# EasyEDA schematic SCH_G431永磁双驱_2024-10-08.json
TITLE: 双永磁驱动板; REV: 1.0; Date: 2024-09-12; Sheet: 1/1; Drawn By: Pudding; Company: 星火行动
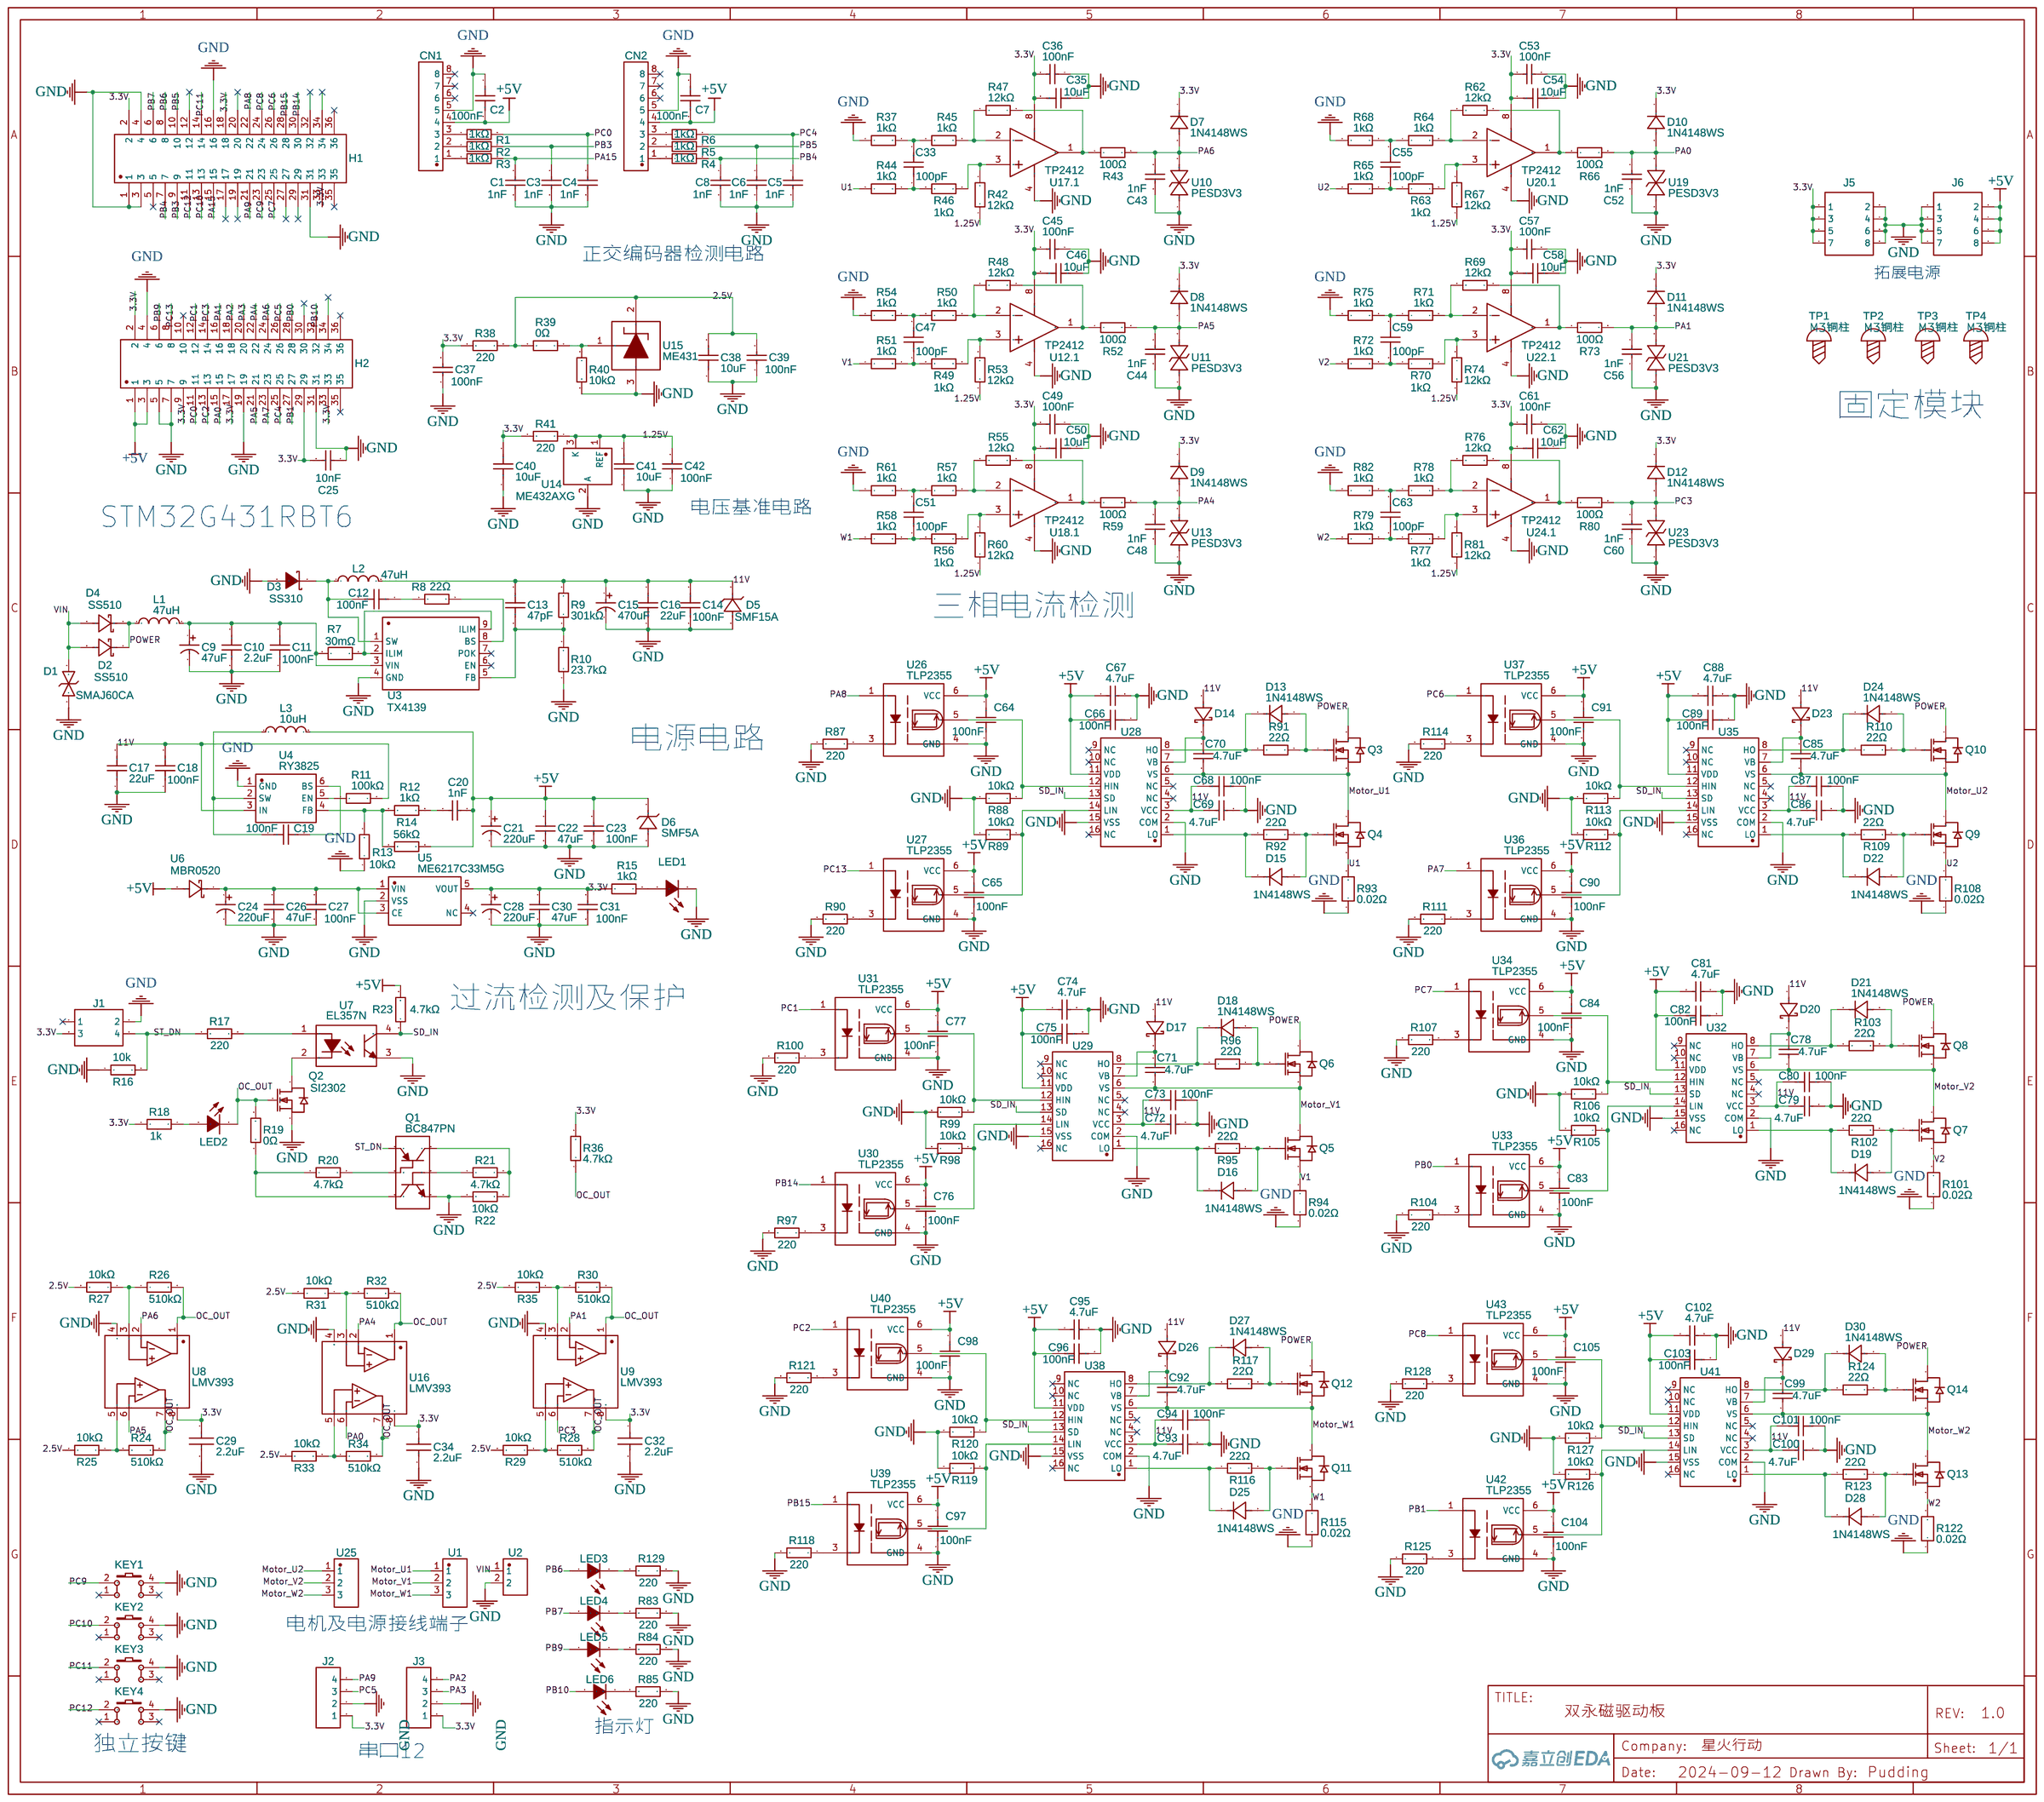
[diagram p0: schematic sheet]

## Parts
C1  1nF  [C0603]
C2  100nF  [C0603]
C3  1nF  [C0603]
C4  1nF  [C0603]
C5  1nF  [C0603]
C6  1nF  [C0603]
C7  100nF  [C0603]
C8  1nF  [C0603]
C9  47uF  [CAP-TH_BD8.0-P3.50-D0.6-FD]
C10  2.2uF  [C1206]
C11  100nF  [C0603]
C12  100nF  [C0603]
C13  47pF  [C0402]
C14  100nF  [C0603]
C15  470uF  [CAP-TH_BD10.0-P5.00-D1.0-FD]
C16  22uF  [C0805]
C17  22uF  [C0805]
C18  100nF  [C0603]
C19  100nF  [C0603]
C20  1nF  [C0603]
C21  220uF  [CAP-SMD_BD6.3-L6.6-W6.6-FD]
C22  47uF  [C0805]
C23  100nF  [C0402]
C24  220uF  [CAP-SMD_BD6.3-L6.6-W6.6-FD]
C25  10nF  [C0805]
C26  47uF  [C0805]
C27  100nF  [C0402]
C28  220uF  [CAP-SMD_BD6.3-L6.6-W6.6-FD]
C29  2.2uF  [C0402]
C30  47uF  [C0805]
C31  100nF  [C0402]
C32  2.2uF  [C0402]
C33  100pF  [C0603]
C34  2.2uF  [C0402]
C35  10uF  [C0603]
C36  100nF  [C0402]
C37  100nF  [C0402]
C38  10uF  [C0603]
C39  100nF  [C0402]
C40  10uF  [C0603]
C41  10uF  [C0603]
C42  100nF  [C0402]
C43  1nF  [C0603]
C44  1nF  [C0603]
C45  100nF  [C0402]
C46  10uF  [C0603]
C47  100pF  [C0603]
C48  1nF  [C0603]
C49  100nF  [C0402]
C50  10uF  [C0603]
C51  100pF  [C0603]
C52  1nF  [C0603]
C53  100nF  [C0402]
C54  10uF  [C0603]
C55  100pF  [C0603]
C56  1nF  [C0603]
C57  100nF  [C0402]
C58  10uF  [C0603]
C59  100pF  [C0603]
C60  1nF  [C0603]
C61  100nF  [C0402]
C62  10uF  [C0603]
C63  100pF  [C0603]
C64  100nF  [C0603]
C65  100nF  [C0603]
C66  100nF  [C0603]
C67  4.7uF  [C0805]
C68  100nF  [C0603]
C69  4.7uF  [C0805]
C70  4.7uF  [C0805]
C71  4.7uF  [C0805]
C72  4.7uF  [C0805]
C73  100nF  [C0603]
C74  4.7uF  [C0805]
C75  100nF  [C0603]
C76  100nF  [C0603]
C77  100nF  [C0603]
C78  4.7uF  [C0805]
C79  4.7uF  [C0805]
C80  100nF  [C0603]
C81  4.7uF  [C0805]
C82  100nF  [C0603]
C83  100nF  [C0603]
C84  100nF  [C0603]
C85  4.7uF  [C0805]
C86  4.7uF  [C0805]
C87  100nF  [C0603]
C88  4.7uF  [C0805]
C89  100nF  [C0603]
C90  100nF  [C0603]
C91  100nF  [C0603]
C92  4.7uF  [C0805]
C93  4.7uF  [C0805]
C94  100nF  [C0603]
C95  4.7uF  [C0805]
C96  100nF  [C0603]
C97  100nF  [C0603]
C98  100nF  [C0603]
C99  4.7uF  [C0805]
C100  4.7uF  [C0805]
C101  100nF  [C0603]
C102  4.7uF  [C0805]
C103  100nF  [C0603]
C104  100nF  [C0603]
C105  100nF  [C0603]
CN1  JL396V-39608G01  [CONN-TH_8P-P3.96_JILN_JL396V-39608G01]
CN2  JL396V-39608G01  [CONN-TH_8P-P3.96_JILN_JL396V-39608G01]
D1  SMAJ60CA  [SMA_L4.4-W2.8-LS5.1-BI]
D2  SS510  [SMA_L4.3-W2.6-LS5.0-RD]
D3  SS310  [SMA_L4.3-W2.6-LS5.2-RD]
D4  SS510  [SMA_L4.3-W2.6-LS5.0-RD]
D5  SMF15A  [SOD-123FL_L2.7-W1.8-LS3.8-RD]
D6  SMF5A  [SOD-123FL_L2.7-W1.8-LS3.8-RD]
D7  1N4148WS  [SOD-323_L1.8-W1.3-LS2.5-RD]
D8  1N4148WS  [SOD-323_L1.8-W1.3-LS2.5-RD]
D9  1N4148WS  [SOD-323_L1.8-W1.3-LS2.5-RD]
D10  1N4148WS  [SOD-323_L1.8-W1.3-LS2.5-RD]
D11  1N4148WS  [SOD-323_L1.8-W1.3-LS2.5-RD]
D12  1N4148WS  [SOD-323_L1.8-W1.3-LS2.5-RD]
D13  1N4148WS  [SOD-323_L1.8-W1.3-LS2.5-RD]
D14  DSK110_C908227  [SOD-123_L2.8-W1.8-LS3.7-FD]
D15  1N4148WS  [SOD-323_L1.8-W1.3-LS2.5-RD]
D16  1N4148WS  [SOD-323_L1.8-W1.3-LS2.5-RD]
D17  DSK110_C908227  [SOD-123_L2.8-W1.8-LS3.7-FD]
D18  1N4148WS  [SOD-323_L1.8-W1.3-LS2.5-RD]
D19  1N4148WS  [SOD-323_L1.8-W1.3-LS2.5-RD]
D20  DSK110_C908227  [SOD-123_L2.8-W1.8-LS3.7-FD]
D21  1N4148WS  [SOD-323_L1.8-W1.3-LS2.5-RD]
D22  1N4148WS  [SOD-323_L1.8-W1.3-LS2.5-RD]
D23  DSK110_C908227  [SOD-123_L2.8-W1.8-LS3.7-FD]
D24  1N4148WS  [SOD-323_L1.8-W1.3-LS2.5-RD]
D25  1N4148WS  [SOD-323_L1.8-W1.3-LS2.5-RD]
D26  DSK110_C908227  [SOD-123_L2.8-W1.8-LS3.7-FD]
D27  1N4148WS  [SOD-323_L1.8-W1.3-LS2.5-RD]
D28  1N4148WS  [SOD-323_L1.8-W1.3-LS2.5-RD]
D29  DSK110_C908227  [SOD-123_L2.8-W1.8-LS3.7-FD]
D30  1N4148WS  [SOD-323_L1.8-W1.3-LS2.5-RD]
H1  210S-2*18P L=11.6MMGold-plated black  [HDR-TH_36P-P2.54-V-M-R2-C18-S2.54-1]
H2  210S-2*18P L=11.6MMGold-plated black  [HDR-TH_36P-P2.54-V-M-R2-C18-S2.54-1]
J1  HDR-M-2.54_2x2  [HDR-M-2.54_2X2]
J2  HDR-M-2.54_1x4  [HDR-M-2.54_1X4]
J3  HDR-M-2.54_1x4  [HDR-M-2.54_1X4]
J5  HDR-M-2.54_2x4  [HDR-M-2.54_2X4]
J6  HDR-M-2.54_2x4  [HDR-M-2.54_2X4]
KEY1  K4-6×6_TH  [KEY-TH_4P-L6.0-W6.0-P4.50-LS6.5]
KEY2  K4-6×6_TH  [KEY-TH_4P-L6.0-W6.0-P4.50-LS6.5]
KEY3  K4-6×6_TH  [KEY-TH_4P-L6.0-W6.0-P4.50-LS6.5]
KEY4  K4-6×6_TH  [KEY-TH_4P-L6.0-W6.0-P4.50-LS6.5]
L1  47uH  [IND-SMD_L11.5-W10.0_SMMS1040]
L2  47uH  [IND-SMD_L11.5-W10.0_SMMS1040]
L3  10uH  [IND-SMD_L7.3-W6.8]
LED1  204-10SUGD/S400-A4-L  [LED-TH_BD3.9-P2.54-RD]
LED2  发光二极管_红色  [LED-TH_BD4.0-P2.54-FD]
LED3  333-2SYGD/S530-E2  [LED-TH_BD5.8-P2.54-L-RD]
LED4  333-2SYGD/S530-E2  [LED-TH_BD5.8-P2.54-L-RD]
LED5  333-2SYGD/S530-E2  [LED-TH_BD5.8-P2.54-L-RD]
LED6  333-2SYGD/S530-E2  [LED-TH_BD5.8-P2.54-L-RD]
Q1  BC847PN  [SOT-363_L2.1-W1.3-P0.65-LS2.3-BL]
Q2  SI2302  [SOT-23-3_L2.9-W1.3-P1.90-LS2.4-BR]
Q3  IRFS3607TRLPBF  [TO-263-2_L10.0-W9.1-P5.08-LS15.2-TL]
Q4  IRFS3607TRLPBF  [TO-263-2_L10.0-W9.1-P5.08-LS15.2-TL]
Q5  IRFS3607TRLPBF  [TO-263-2_L10.0-W9.1-P5.08-LS15.2-TL]
Q6  IRFS3607TRLPBF  [TO-263-2_L10.0-W9.1-P5.08-LS15.2-TL]
Q7  IRFS3607TRLPBF  [TO-263-2_L10.0-W9.1-P5.08-LS15.2-TL]
Q8  IRFS3607TRLPBF  [TO-263-2_L10.0-W9.1-P5.08-LS15.2-TL]
Q9  IRFS3607TRLPBF  [TO-263-2_L10.0-W9.1-P5.08-LS15.2-TL]
Q10  IRFS3607TRLPBF  [TO-263-2_L10.0-W9.1-P5.08-LS15.2-TL]
Q11  IRFS3607TRLPBF  [TO-263-2_L10.0-W9.1-P5.08-LS15.2-TL]
Q12  IRFS3607TRLPBF  [TO-263-2_L10.0-W9.1-P5.08-LS15.2-TL]
Q13  IRFS3607TRLPBF  [TO-263-2_L10.0-W9.1-P5.08-LS15.2-TL]
Q14  IRFS3607TRLPBF  [TO-263-2_L10.0-W9.1-P5.08-LS15.2-TL]
R1  1kΩ  [R0805]
R2  1kΩ  [R0805]
R3  1kΩ  [R0805]
R4  1kΩ  [R0805]
R5  1kΩ  [R0805]
R6  1kΩ  [R0805]
R7  30mΩ  [R1206]
R8  22Ω  [R0603]
R9  301kΩ  [R1206]
R10  23.7kΩ  [R0603]
R11  100kΩ  [R0805]
R12  1kΩ  [R0603]
R13  10kΩ  [R0603]
R14  56kΩ  [R0603]
R15  1kΩ  [RES-TH_BD2.2-L6.5-P10.50-D0.6]
R16  10k  [RES-TH_BD2.2-L6.5-P10.50-D0.6]
R17  220  [RES-TH_BD2.2-L6.5-P10.50-D0.6]
R18  1k  [RES-TH_BD2.2-L6.5-P10.50-D0.6]
R19  0Ω  [R0603]
R20  4.7kΩ  [R0603]
R21  4.7kΩ  [R0603]
R22  10kΩ  [R0603]
R23  4.7kΩ  [R0603]
R24  510kΩ  [R0603]
R25  10kΩ  [R0603]
R26  510kΩ  [R0603]
R27  10kΩ  [R0603]
R28  510kΩ  [R0603]
R29  10kΩ  [R0603]
R30  510kΩ  [R0603]
R31  10kΩ  [R0603]
R32  510kΩ  [R0603]
R33  10kΩ  [R0603]
R34  510kΩ  [R0603]
R35  10kΩ  [R0603]
R36  4.7kΩ  [R0603]
R37  1kΩ  [R0603]
R38  220  [RES-TH_BD2.2-L6.5-P10.50-D0.6]
R39  0Ω  [R0603]
R40  10kΩ  [R0603]
R41  220  [RES-TH_BD2.2-L6.5-P10.50-D0.6]
R42  12kΩ  [R0603]
R43  100Ω  [R0603]
R44  1kΩ  [R0603]
R45  1kΩ  [R0603]
R46  1kΩ  [R0603]
R47  12kΩ  [R0603]
R48  12kΩ  [R0603]
R49  1kΩ  [R0603]
R50  1kΩ  [R0603]
R51  1kΩ  [R0603]
R52  100Ω  [R0603]
R53  12kΩ  [R0603]
R54  1kΩ  [R0603]
R55  12kΩ  [R0603]
R56  1kΩ  [R0603]
R57  1kΩ  [R0603]
R58  1kΩ  [R0603]
R59  100Ω  [R0603]
R60  12kΩ  [R0603]
R61  1kΩ  [R0603]
R62  12kΩ  [R0603]
R63  1kΩ  [R0603]
R64  1kΩ  [R0603]
R65  1kΩ  [R0603]
R66  100Ω  [R0603]
R67  12kΩ  [R0603]
R68  1kΩ  [R0603]
R69  12kΩ  [R0603]
R70  1kΩ  [R0603]
R71  1kΩ  [R0603]
R72  1kΩ  [R0603]
R73  100Ω  [R0603]
R74  12kΩ  [R0603]
R75  1kΩ  [R0603]
R76  12kΩ  [R0603]
R77  1kΩ  [R0603]
R78  1kΩ  [R0603]
R79  1kΩ  [R0603]
R80  100Ω  [R0603]
R81  12kΩ  [R0603]
R82  1kΩ  [R0603]
R83  220  [RES-TH_BD2.2-L6.5-P10.50-D0.6]
R84  220  [RES-TH_BD2.2-L6.5-P10.50-D0.6]
R85  220  [RES-TH_BD2.2-L6.5-P10.50-D0.6]
R87  220  [RES-TH_BD2.2-L6.5-P10.50-D0.6]
R88  10kΩ  [R0603]
R89  10kΩ  [R0603]
R90  220  [RES-TH_BD2.2-L6.5-P10.50-D0.6]
R91  22Ω  [R0805]
R92  22Ω  [R0805]
R93  0.02Ω  [RES-SMD_L6.4-W3.2-R2512]
R94  0.02Ω  [RES-SMD_L6.4-W3.2-R2512]
R95  22Ω  [R0805]
R96  22Ω  [R0805]
R97  220  [RES-TH_BD2.2-L6.5-P10.50-D0.6]
R98  10kΩ  [R0603]
R99  10kΩ  [R0603]
R100  220  [RES-TH_BD2.2-L6.5-P10.50-D0.6]
R101  0.02Ω  [RES-SMD_L6.4-W3.2-R2512]
R102  22Ω  [R0805]
R103  22Ω  [R0805]
R104  220  [RES-TH_BD2.2-L6.5-P10.50-D0.6]
R105  10kΩ  [R0603]
R106  10kΩ  [R0603]
R107  220  [RES-TH_BD2.2-L6.5-P10.50-D0.6]
R108  0.02Ω  [RES-SMD_L6.4-W3.2-R2512]
R109  22Ω  [R0805]
R110  22Ω  [R0805]
R111  220  [RES-TH_BD2.2-L6.5-P10.50-D0.6]
R112  10kΩ  [R0603]
R113  10kΩ  [R0603]
R114  220  [RES-TH_BD2.2-L6.5-P10.50-D0.6]
R115  0.02Ω  [RES-SMD_L6.4-W3.2-R2512]
R116  22Ω  [R0805]
R117  22Ω  [R0805]
R118  220  [RES-TH_BD2.2-L6.5-P10.50-D0.6]
R119  10kΩ  [R0603]
R120  10kΩ  [R0603]
R121  220  [RES-TH_BD2.2-L6.5-P10.50-D0.6]
R122  0.02Ω  [RES-SMD_L6.4-W3.2-R2512]
R123  22Ω  [R0805]
R124  22Ω  [R0805]
R125  220  [RES-TH_BD2.2-L6.5-P10.50-D0.6]
R126  10kΩ  [R0603]
R127  10kΩ  [R0603]
R128  220  [RES-TH_BD2.2-L6.5-P10.50-D0.6]
R129  220  [RES-TH_BD2.2-L6.5-P10.50-D0.6]
TP1  M3铜柱  [M3铜柱]
TP2  M3铜柱  [M3铜柱]
TP3  M3铜柱  [M3铜柱]
TP4  M3铜柱  [M3铜柱]
U1  DB301V-5.0-3P-BU-P  [CONN-TH_3P-P5.00_DB301V-5.0-3P-BU-P]
U2  DB127V-5.0-2P-BU-S  [CONN-TH_DB127V-5.0-2P-XX-S]
U3  TX4139  [SOIC-8_L4.9-W3.9-P1.27-LS6.0-BL-EP]
U4  RY3825  [SOT-23-6_L2.9-W1.6-P0.95-LS2.8-BR]
U5  ME6217C33M5G  [SOT-23-5_L3.0-W1.7-P0.95-LS2.8-BR]
U6  MBR0520  [SOD-123_L2.7-W1.6-LS3.7-RD-A]
U7  EL357N  [OPTO-SMD-4_L4.4-W4.1-P2.54-LS7.0-TL]
U8  LMV393  [MSOP-8_L3.0-W3.0-P0.65-LS5.0-BL]
U9  LMV393  [MSOP-8_L3.0-W3.0-P0.65-LS5.0-BL]
U10  PESD3V3  [SOD-323_L1.7-W1.3-LS2.6-BI]
U11  PESD3V3  [SOD-323_L1.7-W1.3-LS2.6-BI]
U12  TP2412  [SOP-8_L3.0-W3.0-P0.65-LS4.9-BL]  (section 1)
U13  PESD3V3  [SOD-323_L1.7-W1.3-LS2.6-BI]
U14  ME432AXG  [SOT-23-3_L2.9-W1.3-P1.90-LS2.4-BR-CW]
U15  ME431  [SOT-23-3_L2.9-W1.3-P1.90-LS2.4-BR]
U16  LMV393  [MSOP-8_L3.0-W3.0-P0.65-LS5.0-BL]
U17  TP2412  [SOP-8_L3.0-W3.0-P0.65-LS4.9-BL]  (section 1)
U18  TP2412  [SOP-8_L3.0-W3.0-P0.65-LS4.9-BL]  (section 1)
U19  PESD3V3  [SOD-323_L1.7-W1.3-LS2.6-BI]
U20  TP2412  [SOP-8_L3.0-W3.0-P0.65-LS4.9-BL]  (section 1)
U21  PESD3V3  [SOD-323_L1.7-W1.3-LS2.6-BI]
U22  TP2412  [SOP-8_L3.0-W3.0-P0.65-LS4.9-BL]  (section 1)
U23  PESD3V3  [SOD-323_L1.7-W1.3-LS2.6-BI]
U24  TP2412  [SOP-8_L3.0-W3.0-P0.65-LS4.9-BL]  (section 1)
U25  DB301V-5.0-3P-BU-P  [CONN-TH_3P-P5.00_DB301V-5.0-3P-BU-P]
U26  TLP2355  [SOP-6_5P-L4.4-W3.6-P1.27-LS7.0-BR-PE2]
U27  TLP2355  [SOP-6_5P-L4.4-W3.6-P1.27-LS7.0-BR-PE2]
U28  IR2110SPBF  [SOIC-16_L10.3-W7.5-P1.27-LS10.3-BL]
U29  IR2110SPBF  [SOIC-16_L10.3-W7.5-P1.27-LS10.3-BL]
U30  TLP2355  [SOP-6_5P-L4.4-W3.6-P1.27-LS7.0-BR-PE2]
U31  TLP2355  [SOP-6_5P-L4.4-W3.6-P1.27-LS7.0-BR-PE2]
U32  IR2110SPBF  [SOIC-16_L10.3-W7.5-P1.27-LS10.3-BL]
U33  TLP2355  [SOP-6_5P-L4.4-W3.6-P1.27-LS7.0-BR-PE2]
U34  TLP2355  [SOP-6_5P-L4.4-W3.6-P1.27-LS7.0-BR-PE2]
U35  IR2110SPBF  [SOIC-16_L10.3-W7.5-P1.27-LS10.3-BL]
U36  TLP2355  [SOP-6_5P-L4.4-W3.6-P1.27-LS7.0-BR-PE2]
U37  TLP2355  [SOP-6_5P-L4.4-W3.6-P1.27-LS7.0-BR-PE2]
U38  IR2110SPBF  [SOIC-16_L10.3-W7.5-P1.27-LS10.3-BL]
U39  TLP2355  [SOP-6_5P-L4.4-W3.6-P1.27-LS7.0-BR-PE2]
U40  TLP2355  [SOP-6_5P-L4.4-W3.6-P1.27-LS7.0-BR-PE2]
U41  IR2110SPBF  [SOIC-16_L10.3-W7.5-P1.27-LS10.3-BL]
U42  TLP2355  [SOP-6_5P-L4.4-W3.6-P1.27-LS7.0-BR-PE2]
U43  TLP2355  [SOP-6_5P-L4.4-W3.6-P1.27-LS7.0-BR-PE2]

## Library data of the parts
C1 C3-C6 C8 C43 C44 C48 C52 C56 C60 = CC0603KRX7R9BB102: Supplier: LCSC; Manufacturer: YAGEO(国巨); Supplier Part: C100040; JLCPCB Part Class: Extended Part
C2 C7 = CC0603KRX7R9BB104: Supplier: LCSC; Manufacturer: YAGEO(国巨); Supplier Part: C14663; JLCPCB Part Class: Basic Part
C9 = ERS1KM470F12OT: Contributor: LCSC; Supplier: LCSC; Manufacturer: AISHI(艾华集团); Supplier Part: C106688; JLCPCB Part Class: Extended Part
C10 = CL31B225KCHSNNE: Contributor: LCSC; Supplier: LCSC; Supplier Part: C170101; Manufacturer: SAMSUNG(三星); JLCPCB Part Class: Extended Part
C11 C12 C14 C18 C19 C64-C66 C68 C73 C75-C77 C80 C82-C84 C87 C89-C91 C94 C96-C98 C101 C103-C105 = CL10B104KC8NNNC: Supplier: LCSC; Manufacturer: SAMSUNG(三星); Supplier Part: C15725; JLCPCB Part Class: Extended Part
C13 = 0402CG470G500NT: Contributor: LCSC; Supplier: LCSC; Supplier Part: C285090; Manufacturer: FH(风华); JLCPCB Part Class: Extended Part
C15 = ERS1HM471G20OT: Supplier: LCSC; Manufacturer: AISHI(艾华集团); Supplier Part: C106666; JLCPCB Part Class: Extended Part
C16 C17 = CL21A226MAQNNNE: Supplier: LCSC; Manufacturer: SAMSUNG(三星); Supplier Part: C45783; JLCPCB Part Class: Basic Part
C20 = CL10B102KB8NNNC: Supplier: LCSC; Manufacturer: SAMSUNG(三星); Supplier Part: C1588; JLCPCB Part Class: Basic Part
C21 C24 C28 = VT1C221M0607: Supplier: LCSC; Manufacturer: ROQANG(容强); Supplier Part: C90274
C22 C26 C30 = CL21A476MQYNNNE: Supplier: LCSC; Manufacturer: SAMSUNG(三星); Supplier Part: C16780; JLCPCB Part Class: Basic Part
C23 C27 C31 C36 C37 C39 C42 C45 C49 C53 C57 C61 = 0402B104K160NT: Supplier: LCSC; Manufacturer: FH(风华); Supplier Part: C41851; JLCPCB Part Class: Extended Part
C25 = CL21A106KAYNNNE: Supplier: LCSC; Manufacturer: SAMSUNG; LCSC Assembly: Yes; Supplier Part: C15850; SMT Type: Basic
C29 C32 C34 = CL05A225MQ5NSNC: Supplier: LCSC; Manufacturer: SAMSUNG(三星); Supplier Part: C12530; JLCPCB Part Class: Basic Part
C33 C47 C51 C55 C59 C63 = CC0603JRNPO9BN101: Supplier: LCSC; Manufacturer: YAGEO(国巨); Supplier Part: C14665; JLCPCB Part Class: Extended Part
C35 C38 C40 C41 C46 C50 C54 C58 C62 = CL10A106KP8NNNC: Supplier: LCSC; Manufacturer: SAMSUNG(三星); Supplier Part: C19702; JLCPCB Part Class: Basic Part
C67 C69-C72 C74 C78 C79 C81 C85 C86 C88 C92 C93 C95 C99 C100 C102 = CL21A475KAQNNNE: Supplier: LCSC; Manufacturer: SAMSUNG(三星); Supplier Part: C1779; JLCPCB Part Class: Basic Part
CN1 CN2 = JL396V-39608G01: Contributor: LCSC; Supplier: LCSC; Supplier Part: C2913363; Manufacturer: JILN(锦凌); JLCPCB Part Class: Extended Part
D1 = SMAJ60CA_C2922199: Contributor: LCSC; Supplier: LCSC; Supplier Part: C2922199; Manufacturer: GOODWORK(固得沃克); JLCPCB Part Class: Extended Part
D2 D4 = SS510_C727067: Contributor: LCSC; Supplier: LCSC; Supplier Part: C727067; Manufacturer: TWGMC(台湾迪嘉); JLCPCB Part Class: Extended Part
D3 = SS310: Supplier: LCSC; Manufacturer: MDD(辰达半导体); Supplier Part: C15874; JLCPCB Part Class: Extended Part
D5 = SMF15A_C19077509: Supplier: LCSC; Supplier Part: C19077509; Manufacturer: 宏迦橙; Contributor: lcsc
D6 = SMF5.0A_C908213: Contributor: LCSC; Supplier: LCSC; Supplier Part: C908213; Manufacturer: FUXINSEMI(富芯森美); Manufacturer Part: SMF5.0A; JLCPCB Part Class: Extended Part
D7-D13 D15 D16 D18 D19 D21 D22 D24 D25 D27 D28 D30 = 1N4148WS_C917117: Contributor: LCSC; Supplier: LCSC; Supplier Part: C917117; Manufacturer: JSMSEMI(杰盛微); JLCPCB Part Class: Extended Part
D14 D17 D20 D23 D26 D29 = DSK110_C908227: Contributor: LCSC; Supplier: LCSC; Supplier Part: C908227; Manufacturer: FUXINSEMI(富芯森美); Manufacturer Part: DSK110; JLCPCB Part Class: Extended Part
H1 H2 = 210S-2*18P L=11.6MMGold-plated black: Contributor: LCSC; Supplier: LCSC; Supplier Part: C168945; Manufacturer: Ckmtw(灿科盟); JLCPCB Part Class: Extended Part
J1 = HDR-M-2.54_2x2: Supplier Part: C66690; Supplier: LCSC; Contributor: LCEDA_Lib
J2 J3 = HDR-M-2.54_1x4: Supplier Part: C124378; Supplier: LCSC; Contributor: LCEDA_Lib
J5 J6 = HDR-M-2.54_2x4: Supplier Part: C58363; Supplier: LCSC; Contributor: LCEDA_Lib
KEY1-KEY4 = K4-6×6_TH: Supplier: LCSC; Supplier Part: C136684; Manufacturer: 韩国韩荣; Manufacturer Part: K2-1102DP-E4SW-04; Contributor: LCEDA_Lib
L1 L2 = SMMS1040-470M: Supplier: LCSC; Manufacturer: SXN(顺翔诺); Supplier Part: C149599; JLCPCB Part Class: Extended Part
L3 = FXL0630-100-M: Contributor: LCSC; Supplier: LCSC; Manufacturer: cjiang(长江微电); Supplier Part: C167223; JLCPCB Part Class: Extended Part
LED1 = 204-10SUGD/S400-A4-L: Contributor: lcsc; Supplier: LCSC; Supplier Part: C778892; Manufacturer: EVERLIGHT(亿光); JLCPCB Part Class: Extended Part
LED2 = 发光二极管_红色: Contributor: lcsc; Supplier: LCSC; Supplier Part: C9900001850; Manufacturer: null; JLCPCB Part Class: Extended Part
LED3-LED6 = 333-2SYGD/S530-E2: Supplier: LCSC; Manufacturer: EVERLIGHT; Supplier Part: C88163; Paste Type: expand
Q1 = BC847PN: Contributor: lcsc; Supplier: LCSC; Supplier Part: C2991946; Manufacturer: CJ(江苏长电/长晶); JLCPCB Part Class: Extended Part
Q2 = SI2302_C4748714: Contributor: lcsc; Supplier: LCSC; Supplier Part: C4748714; Manufacturer: HXY MOSFET(华轩阳电子); Manufacturer Part: SI2302-HXY; JLCPCB Part Class: Extended Part
Q3-Q14 = IRFS3607TRLPBF: Supplier: LCSC; Manufacturer: Infineon(英飞凌); Supplier Part: C22162; JLCPCB Part Class: Extended Part
R1-R6 = 0805W8F1001T5E: Supplier: LCSC; Manufacturer: UNI-ROYAL(厚声); Supplier Part: C17513; JLCPCB Part Class: Basic Part
R7 = HOYLR1206-1W-30MR-1%: Supplier: LCSC; Supplier Part: C5375399; Manufacturer: Milliohm(毫欧); Manufacturer Part: HoYLR1206-1W-30mR-1%; Contributor: lcsc; JLCPCB Part Class: Extended Part
R8 = 0603WAF220JT5E: Supplier: LCSC; Manufacturer: UNI-ROYAL(厚声); Supplier Part: C23345; JLCPCB Part Class: Basic Part
R9 = RCT06301KFLF: Contributor: LCSC; Supplier: LCSC; Supplier Part: C185725; Manufacturer: HKR(香港电阻); JLCPCB Part Class: Extended Part
R10 = 0603WAF2372T5E: Supplier: LCSC; Manufacturer: UNI-ROYAL(厚声); Supplier Part: C22912; JLCPCB Part Class: Extended Part
R11 = 0805W8F1003T5E_C149504: Contributor: LCSC; Supplier: LCSC; Supplier Part: C149504; Manufacturer: UNI-ROYAL(厚声); Manufacturer Part: 0805W8F1003T5E; JLCPCB Part Class: Basic Part
R12 R37 R44-R46 R49-R51 R54 R56-R58 R61 R63-R65 R68 R70-R72 R75 R77-R79 R82 = 0603WAF1001T5E: Supplier: LCSC; Manufacturer: UNI-ROYAL(厚声); Supplier Part: C21190; JLCPCB Part Class: Basic Part
R13 R22 R25 R27 R29 R31 R33 R35 R40 R88 R89 R98 R99 R105 R106 R112 R113 R119 R120 R126 R127 = 0603WAF1002T5E: Supplier: LCSC; Manufacturer: UNI-ROYAL(厚声); Supplier Part: C25804; JLCPCB Part Class: Basic Part
R14 = 0603WAF5602T5E: Supplier: LCSC; Manufacturer: UNI-ROYAL(厚声); Supplier Part: C23206; JLCPCB Part Class: Basic Part
R15 = MFR0W4F1000A50: Supplier: LCSC; Manufacturer: UNI-ROYAL(厚声); Supplier Part: C57438; JLCPCB Part Class: Extended Part
R16-R18 R38 R41 R83-R85 R87 R90 R97 R100 R104 R107 R111 R114 R118 R121 R125 R128 R129 = MFR0W4F4701A50: Supplier: LCSC; Manufacturer: UniOhm; Supplier Part: C57204; JLCPCB Part Class: Extended Part
R19 R39 = 0603WAF0000T5E: Supplier: LCSC; Manufacturer: UNI-ROYAL(厚声); Supplier Part: C21189; JLCPCB Part Class: Basic Part
R20 R21 R23 R36 = 0603WAF4701T5E: Supplier: LCSC; Manufacturer: UNI-ROYAL(厚声); Supplier Part: C23162; JLCPCB Part Class: Basic Part
R24 R26 R28 R30 R32 R34 = 0603WAF5103T5E: Supplier: LCSC; Manufacturer: UNI-ROYAL(厚声); Supplier Part: C23192; JLCPCB Part Class: Basic Part
R42 R47 R48 R53 R55 R60 R62 R67 R69 R74 R76 R81 = 0603WAF1202T5E: Supplier: LCSC; Manufacturer: UNI-ROYAL(厚声); Supplier Part: C22790; JLCPCB Part Class: Basic Part
R43 R52 R59 R66 R73 R80 = RC0603FR-07100RL: Supplier: LCSC; Manufacturer: YAGEO(国巨); Supplier Part: C105588; JLCPCB Part Class: Extended Part
R91 R92 R95 R96 R102 R103 R109 R110 R116 R117 R123 R124 = 0805W8F220JT5E: Supplier: LCSC; Manufacturer: UNI-ROYAL(厚声); Supplier Part: C17561; JLCPCB Part Class: Basic Part
R93 R94 R101 R108 R115 R122 = PA2512FKF7W0R02E: Contributor: LCSC; Supplier: LCSC; Supplier Part: C728347; Manufacturer: YAGEO(国巨); JLCPCB Part Class: Extended Part
TP1-TP4 = M3铜柱: Contributor: feiyuan1
U1 U25 = DB301V-5.0-3P-BU-P: Contributor: LCSC; Supplier: LCSC; Supplier Part: C430620; Manufacturer: DORABO(地博电气); JLCPCB Part Class: Extended Part
U2 = DB127V-5.0-2P-BU-S: Contributor: LCSC; Supplier: LCSC; Supplier Part: C500019; Manufacturer: DORABO(地博电气); JLCPCB Part Class: Extended Part
U3 = TX4139: Contributor: LCSC; Supplier: LCSC; Supplier Part: C329266; Manufacturer: XDS(芯鼎盛); JLCPCB Part Class: Extended Part
U4 = RY3825: Contributor: LCSC; Supplier: LCSC; Supplier Part: C370760; Manufacturer: RYCHiP(蕊源); JLCPCB Part Class: Extended Part
U5 = ME6217C33M5G: Contributor: LCSC; Supplier: LCSC; Supplier Part: C427602; Manufacturer: MICRONE(南京微盟); JLCPCB Part Class: Extended Part
U6 = MBR0520_C5204745: Supplier: LCSC; Supplier Part: C5204745; Manufacturer: TWGMC(台湾迪嘉); JLCPCB Part Class: Extended Part; Contributor: lcsc
U7 = EL357N(C)(TA)-G: Supplier: LCSC; Manufacturer: EVERLIGHT(亿光); Supplier Part: C29981; JLCPCB Part Class: Basic Part
U8 U9 U16 = LMV393TP-VR: Contributor: LCSC; Supplier: LCSC; Supplier Part: C248586; Manufacturer: 3PEAK; JLCPCB Part Class: Extended Part
U10 U11 U13 U19 U21 U23 = PESD3V3L1BA_C2687129: Contributor: lcsc; Supplier: LCSC; Supplier Part: C2687129; Manufacturer: UMW(友台半导体); Manufacturer Part: PESD3V3L1BA; JLCPCB Part Class: Extended Part
U12 U17 U18 U20 U22 U24 = TP2412-VR: subpart_no: 1; Supplier: LCSC; Supplier Part: C248606; Manufacturer: 3PEAK; JLCPCB Part Class: Extended Part
U14 = ME432AXG: Contributor: LCSC; Supplier: LCSC; Supplier Part: C487903; Manufacturer: MICRONE(南京微盟); JLCPCB Part Class: Extended Part
U15 = ME431AXG: Supplier: LCSC; Manufacturer: MICRONE(南京微盟); Supplier Part: C85795; JLCPCB Part Class: Extended Part
U26 U27 U30 U31 U33 U34 U36 U37 U39 U40 U42 U43 = TLP2355(E: Supplier: LCSC; Supplier Part: C7124341; Manufacturer: TOSHIBA(东芝); Contributor: lcsc; JLCPCB Part Class: Extended Part
U28 U29 U32 U35 U38 U41 = IR2110SPBF: Contributor: LCSC; Supplier: LCSC; Supplier Part: C537554; Manufacturer: Infineon(英飞凌); JLCPCB Part Class: Extended Part

## Nets
1.25V: C41.2 C42.2 R41.1 R42.1 R53.1 R60.1 R67.1 R74.1 R81.1 U14.1(REF) U14.3(K)
2.5V: C38.2 C39.2 R25.2 R27.2 R29.2 R31.2 R33.2 R35.2 R38.1 R39.2 U15.2(C)
3.3V: C25.2 C28.1 C29.1 C30.2 C31.2 C32.1 C34.1 C35.2 C36.2 C37.2 C40.2 C45.2 C46.2 C49.2 C50.2 C53.2 C54.2 C57.2 C58.2 C61.2 C62.2 D7.1(C) D8.1(C) D9.1(C) D10.1(C) D11.1(C) D12.1(C) H1.2 H1.18 H1.33 H2.2 H2.9 H2.17 H2.29 H2.33 J1.3 J2.1 J3.1 J5.1 J5.3 J5.5 J5.7 R15.1 R18.2 R36.2 R38.2 R41.2 U5.5(VOUT) U8.8(VDD) U9.8(VDD) U12.8(+VS) U16.8(VDD) U17.8(+VS) U18.8(+VS) U20.8(+VS) U22.8(+VS) U24.8(+VS)
11V: C13.2 C14.2 C15.1 C16.2 C17.2 C18.2 C68.1 C69.1 C72.1 C73.1 C79.1 C80.1 C86.1 C87.1 C93.1 C94.1 C100.1 C101.1 D5.1(K) D14.1(A) D17.1(A) D20.1(A) D23.1(A) D26.1(A) D29.1(A) L2.2 R9.2 R11.2 U4.3(IN) U28.3(VCC) U29.3(VCC) U32.3(VCC) U35.3(VCC) U38.3(VCC) U41.3(VCC)
+5V: C2.2 C7.2 C20.2 C21.1 C22.2 C23.2 C64.1 C65.1 C66.1 C67.1 C74.1 C75.1 C76.1 C77.1 C81.1 C82.1 C83.1 C84.1 C88.1 C89.1 C90.1 C91.1 C95.1 C96.1 C97.1 C98.1 C102.1 C103.1 C104.1 C105.1 CN1.4 CN2.4 D6.1(C) H2.1 H2.3 J6.2 J6.4 J6.6 J6.8 L3.2 R14.2 R23.2 U6.2(A) U26.6(VCC) U27.6(VCC) U28.11(VDD) U29.11(VDD) U30.6(VCC) U31.6(VCC) U32.11(VDD) U33.6(VCC) U34.6(VCC) U35.11(VDD) U36.6(VCC) U37.6(VCC) U38.11(VDD) U39.6(VCC) U40.6(VCC) U41.11(VDD) U42.6(VCC) U43.6(VCC)
GND: C1.2 C2.1 C3.2 C4.2 C5.2 C6.2 C7.1 C8.2 C9.2 C10.1 C11.1 C14.1 C15.2 C16.1 C17.1 C18.1 C21.2 C22.1 C23.1 C24.2 C25.1 C26.1 C27.1 C28.2 C29.2 C30.1 C31.1 C32.2 C34.2 C35.1 C36.1 C37.1 C38.1 C39.1 C40.1 C41.1 C42.1 C43.2 C44.2 C45.1 C46.1 C48.2 C49.1 C50.1 C52.2 C53.1 C54.1 C56.2 C57.1 C58.1 C60.2 C61.1 C62.1 C64.2 C65.2 C66.2 C67.2 C68.2 C69.2 C72.2 C73.2 C74.2 C75.2 C76.2 C77.2 C79.2 C80.2 C81.2 C82.2 C83.2 C84.2 C86.2 C87.2 C88.2 C89.2 C90.2 C91.2 C93.2 C94.2 C95.2 C96.2 C97.2 C98.2 C100.2 C101.2 C102.2 C103.2 C104.2 C105.2 CN1.5 CN2.5 D1.1 D3.2(A) D5.2(A) D6.2(A) H1.1 H1.3 H1.4 H1.16 H1.31 H2.4 H2.5 H2.7 H2.19 H2.31 J1.2 J2.2 J3.2 J5.2 J5.4 J5.6 J5.8 J6.1 J6.3 J6.5 J6.7 KEY1.4 KEY2.4 KEY3.4 KEY4.4 LED1.1(-) Q1.1(E1) Q2.2(S) R10.1 R13.1 R16.1 R22.2 R37.1 R40.2 R54.1 R61.1 R68.1 R75.1 R82.1 R83.1 R84.1 R85.1 R87.2 R88.2 R89.2 R90.2 R93.1 R94.1 R97.2 R98.2 R99.2 R100.2 R101.1 R104.2 R105.2 R106.2 R107.2 R108.1 R111.2 R112.2 R113.2 R114.2 R115.1 R118.2 R119.2 R120.2 R121.2 R122.1 R125.2 R126.2 R127.2 R128.2 R129.1 U2.2 U3.4(GND) U4.1(GND) U5.2(VSS) U7.3(EM) U8.4(GND) U9.4(GND) U10.1 U11.1 U12.4(-VS) U13.1 U14.2(A) U15.3(A) U16.4(GND) U17.4(-VS) U18.4(-VS) U19.1 U20.4(-VS) U21.1 U22.4(-VS) U23.1 U24.4(-VS) U26.4(GND) U27.4(GND) U28.2(COM) U28.15(VSS) U29.2(COM) U29.15(VSS) U30.4(GND) U31.4(GND) U32.2(COM) U32.15(VSS) U33.4(GND) U34.4(GND) U35.2(COM) U35.15(VSS) U36.4(GND) U37.4(GND) U38.2(COM) U38.15(VSS) U39.4(GND) U40.4(GND) U41.2(COM) U41.15(VSS) U42.4(GND) U43.4(GND)
V1: Q5.3(S) R51.1 R94.2
V2: Q7.3(S) R72.1 R101.2
VIN: D1.2 D2.2(A) D4.2(A) U2.1
Motor_U1: C70.1 Q3.3(S) Q4.4(D) U1.1 U28.6(VS)
Motor_U2: C85.1 Q9.4(D) Q10.3(S) U25.1 U35.6(VS)
Motor_V1: C71.1 Q5.4(D) Q6.3(S) U1.2 U29.6(VS)
Motor_V2: C78.1 Q7.4(D) Q8.3(S) U25.2 U32.6(VS)
Motor_W1: C92.1 Q11.4(D) Q12.3(S) U1.3 U38.6(VS)
Motor_W2: C99.1 Q13.4(D) Q14.3(S) U25.3 U41.6(VS)
OC_OUT: LED2.2(-) Q2.1(G) R19.2 R24.2 R26.2 R28.2 R30.2 R32.2 R34.2 R36.1 U8.1 U8.7 U9.1 U9.7 U16.1 U16.7
PA0: C52.1 D10.2(A) H2.15 R66.2 U16.6 U19.2
PA1: C56.1 D11.2(A) H2.16 R73.2 U9.2 U21.2
PA2: H2.18 J3.4
PA3: H2.20 J3.3
PA4: C48.1 D9.2(A) H2.22 R59.2 U13.2 U16.2
PA5: C44.1 D8.2(A) H2.21 R52.2 U8.6 U11.2
PA6: C43.1 D7.2(A) H2.24 R43.2 U8.2 U10.2
PA7: H2.23 U36.1(AN)
PA8: H1.22 U26.1(AN)
PA9: H1.21 J2.4
PA15: C1.1 H1.15 R3.2
PB0: H2.28 U33.1(AN)
PB1: H2.27 U42.1(AN)
PB3: C3.1 H1.9 R2.2
PB4: C8.1 H1.7 R4.2
PB5: C6.1 H1.10 R5.2
PB6: H1.8 LED3.2(A)
PB7: H1.6 LED4.2(A)
PB9: H2.6 LED5.2(A)
PB10: H2.32 LED6.2(A)
PB14: H1.30 U30.1(AN)
PB15: H1.28 U39.1(AN)
PC0: C4.1 H2.11 R1.2
PC1: H2.12 U31.1(AN)
PC2: H2.13 U40.1(AN)
PC3: C60.1 D12.2(A) H2.14 R80.2 U9.6 U23.2
PC4: C5.1 H2.25 R6.2
PC5: H2.26 J2.3
PC6: H1.26 U37.1(AN)
PC7: H1.25 U34.1(AN)
PC8: H1.24 U43.1(AN)
PC9: H1.23 KEY1.2
PC10: H1.13 KEY2.2
PC11: H1.14 KEY3.2
PC12: H1.11 KEY4.2
PC13: H2.8 U27.1(AN)
POWER: D2.1(K) D4.1(K) L1.1 Q3.4(D) Q6.4(D) Q8.4(D) Q10.4(D) Q12.4(D) Q14.4(D)
SD_IN: R23.1 U7.4(COL) U28.13(SD) U29.13(SD) U32.13(SD) U35.13(SD) U38.13(SD) U41.13(SD)
ST_DN: J1.4 Q1.4(E2) R16.2 R17.2
U1: Q4.3(S) R44.1 R93.2
U2: Q9.3(S) R65.1 R108.2
W1: Q11.3(S) R58.1 R115.2
W2: Q13.3(S) R79.1 R122.2
Net-(C9-1): C9.1 C10.2 C11.2 L1.2 R7.1 U3.3(VIN)
Net-(C12-1): C12.1 R8.1
Net-(C12-2): C12.2 D3.1(K) L2.1 U3.1(SW)
Net-(C13-1): C13.1 R9.1 R10.2 U3.5(FB)
Net-(C19-1): C19.1 U4.6(BS)
Net-(C19-2): C19.2 L3.1 U4.2(SW)
Net-(C20-1): C20.1 R12.2
Net-(C24-1): C24.1 C26.2 C27.2 U5.1(VIN) U5.3(CE) U6.1(K)
Net-(C33-1): C33.1 R44.2 R46.1
Net-(C33-2): C33.2 R37.2 R45.1
Net-(C47-1): C47.1 R49.1 R51.2
Net-(C47-2): C47.2 R50.1 R54.2
Net-(C51-1): C51.1 R56.1 R58.2
Net-(C51-2): C51.2 R57.1 R61.2
Net-(C55-1): C55.1 R63.1 R65.2
Net-(C55-2): C55.2 R64.1 R68.2
Net-(C59-1): C59.1 R70.1 R72.2
Net-(C59-2): C59.2 R71.1 R75.2
Net-(C63-1): C63.1 R77.1 R79.2
Net-(C63-2): C63.2 R78.1 R82.2
Net-(C70-2): C70.2 D14.2(K) U28.7(VB)
Net-(C71-2): C71.2 D17.2(K) U29.7(VB)
Net-(C78-2): C78.2 D20.2(K) U32.7(VB)
Net-(C85-2): C85.2 D23.2(K) U35.7(VB)
Net-(C92-2): C92.2 D26.2(K) U38.7(VB)
Net-(C99-2): C99.2 D29.2(K) U41.7(VB)
Net-(CN1-1): CN1.1 R3.1
Net-(CN1-2): CN1.2 R2.1
Net-(CN1-3): CN1.3 R1.1
Net-(CN2-1): CN2.1 R4.1
Net-(CN2-2): CN2.2 R5.1
Net-(CN2-3): CN2.3 R6.1
Net-(D13-1): D13.1(C) R91.1 U28.8(HO)
Net-(D13-2): D13.2(A) Q3.1(G) R91.2
Net-(D15-1): D15.1(C) R92.1 U28.1(LO)
Net-(D15-2): D15.2(A) Q4.1(G) R92.2
Net-(D16-1): D16.1(C) R95.1 U29.1(LO)
Net-(D16-2): D16.2(A) Q5.1(G) R95.2
Net-(D18-1): D18.1(C) R96.1 U29.8(HO)
Net-(D18-2): D18.2(A) Q6.1(G) R96.2
Net-(D19-1): D19.1(C) R102.1 U32.1(LO)
Net-(D19-2): D19.2(A) Q7.1(G) R102.2
Net-(D21-1): D21.1(C) R103.1 U32.8(HO)
Net-(D21-2): D21.2(A) Q8.1(G) R103.2
Net-(D22-1): D22.1(C) R109.1 U35.1(LO)
Net-(D22-2): D22.2(A) Q9.1(G) R109.2
Net-(D24-1): D24.1(C) R110.1 U35.8(HO)
Net-(D24-2): D24.2(A) Q10.1(G) R110.2
Net-(D25-1): D25.1(C) R116.1 U38.1(LO)
Net-(D25-2): D25.2(A) Q11.1(G) R116.2
Net-(D27-1): D27.1(C) R117.1 U38.8(HO)
Net-(D27-2): D27.2(A) Q12.1(G) R117.2
Net-(D28-1): D28.1(C) R123.1 U41.1(LO)
Net-(D28-2): D28.2(A) Q13.1(G) R123.2
Net-(D30-1): D30.1(C) R124.1 U41.8(HO)
Net-(D30-2): D30.2(A) Q14.1(G) R124.2
Net-(LED1-2): LED1.2(+) R15.2
Net-(LED2-1): LED2.1(+) R18.1
Net-(LED3-1): LED3.1(C) R129.2
Net-(LED4-1): LED4.1(C) R83.2
Net-(LED5-1): LED5.1(C) R84.2
Net-(LED6-1): LED6.1(C) R85.2
Net-(Q1-2): Q1.2(B1) R21.1
Net-(Q1-3): Q1.3(C2) R21.2 R22.1
Net-(Q1-5): Q1.5(B2) R20.2
Net-(Q1-6): Q1.6(C1) R19.1 R20.1
Net-(Q2-3): Q2.3(D) U7.2(CAT)
Net-(R7-2): R7.2 U3.2(ILIM) U3.9(ILIM)
Net-(R8-2): R8.2 U3.8(BS)
Net-(R11-1): R11.1 U4.5(EN)
Net-(R12-1): R12.1 R13.2 R14.1 U4.4(FB)
Net-(R17-1): R17.1 U7.1(AN)
Net-(R24-1): R24.1 R25.1 U8.5
Net-(R26-1): R26.1 R27.1 U8.3
Net-(R28-1): R28.1 R29.1 U9.5
Net-(R30-1): R30.1 R35.1 U9.3
Net-(R31-1): R31.1 R32.1 U16.3
Net-(R33-1): R33.1 R34.1 U16.5
Net-(R39-1): R39.1 R40.1 U15.1(REF)
Net-(R42-2): R42.2 R46.2 U17.3(+INA)
Net-(R43-1): R43.1 R47.1 U17.1(OUTA)
Net-(R45-2): R45.2 R47.2 U17.2(-INA)
Net-(R48-1): R48.1 R52.1 U12.1(OUTA)
Net-(R48-2): R48.2 R50.2 U12.2(-INA)
Net-(R49-2): R49.2 R53.2 U12.3(+INA)
Net-(R55-1): R55.1 R59.1 U18.1(OUTA)
Net-(R55-2): R55.2 R57.2 U18.2(-INA)
Net-(R56-2): R56.2 R60.2 U18.3(+INA)
Net-(R62-1): R62.1 R66.1 U20.1(OUTA)
Net-(R62-2): R62.2 R64.2 U20.2(-INA)
Net-(R63-2): R63.2 R67.2 U20.3(+INA)
Net-(R69-1): R69.1 R73.1 U22.1(OUTA)
Net-(R69-2): R69.2 R71.2 U22.2(-INA)
Net-(R70-2): R70.2 R74.2 U22.3(+INA)
Net-(R76-1): R76.1 R80.1 U24.1(OUTA)
Net-(R76-2): R76.2 R78.2 U24.2(-INA)
Net-(R77-2): R77.2 R81.2 U24.3(+INA)
Net-(R87-1): R87.1 U26.3(CAT)
Net-(R88-1): R88.1 U26.5(VO) U28.12(HIN)
Net-(R89-1): R89.1 U27.5(VO) U28.14(LIN)
Net-(R90-1): R90.1 U27.3(CAT)
Net-(R97-1): R97.1 U30.3(CAT)
Net-(R98-1): R98.1 U29.14(LIN) U30.5(VO)
Net-(R99-1): R99.1 U29.12(HIN) U31.5(VO)
Net-(R100-1): R100.1 U31.3(CAT)
Net-(R104-1): R104.1 U33.3(CAT)
Net-(R105-1): R105.1 U32.14(LIN) U33.5(VO)
Net-(R106-1): R106.1 U32.12(HIN) U34.5(VO)
Net-(R107-1): R107.1 U34.3(CAT)
Net-(R111-1): R111.1 U36.3(CAT)
Net-(R112-1): R112.1 U35.14(LIN) U36.5(VO)
Net-(R113-1): R113.1 U35.12(HIN) U37.5(VO)
Net-(R114-1): R114.1 U37.3(CAT)
Net-(R118-1): R118.1 U39.3(CAT)
Net-(R119-1): R119.1 U38.14(LIN) U39.5(VO)
Net-(R120-1): R120.1 U38.12(HIN) U40.5(VO)
Net-(R121-1): R121.1 U40.3(CAT)
Net-(R125-1): R125.1 U42.3(CAT)
Net-(R126-1): R126.1 U41.14(LIN) U42.5(VO)
Net-(R127-1): R127.1 U41.12(HIN) U43.5(VO)
Net-(R128-1): R128.1 U43.3(CAT)

Not connected (* = marked no-connect by the designer): CN1 6* 7* 8*; CN2 6* 7* 8*; H1 5* 12 17 19 20 27 29 32 34 35* 36*; H2 10* 30 34 35* 36*; J1 1*; KEY1 1* 3*; KEY2 1* 3*; KEY3 1* 3*; KEY4 1* 3*; U3 6(EN)* 7(POK)*; U5 4(NC)*; U28 4(NC)* 5(NC)* 9(NC)* 10(NC)* 16(NC)*; U29 4(NC)* 5(NC)* 9(NC)* 10(NC)* 16(NC)*; U32 4(NC)* 5(NC)* 9(NC)* 10(NC)* 16(NC)*; U35 4(NC)* 5(NC)* 9(NC)* 10(NC)* 16(NC)*; U38 4(NC)* 5(NC)* 9(NC)* 10(NC)* 16(NC)*; U41 4(NC)* 5(NC)* 9(NC)* 10(NC)* 16(NC)*

## Notes on the sheet
- 正交编码器检测电路
- 拓展电源
- 固定模块
- STM32G431RBT6
- 电压基准电路
- 三相电流检测
- 电源电路
- 过流检测及保护
- 电机及电源接线端子
- 指示灯
- 独立按键
- 串口12
